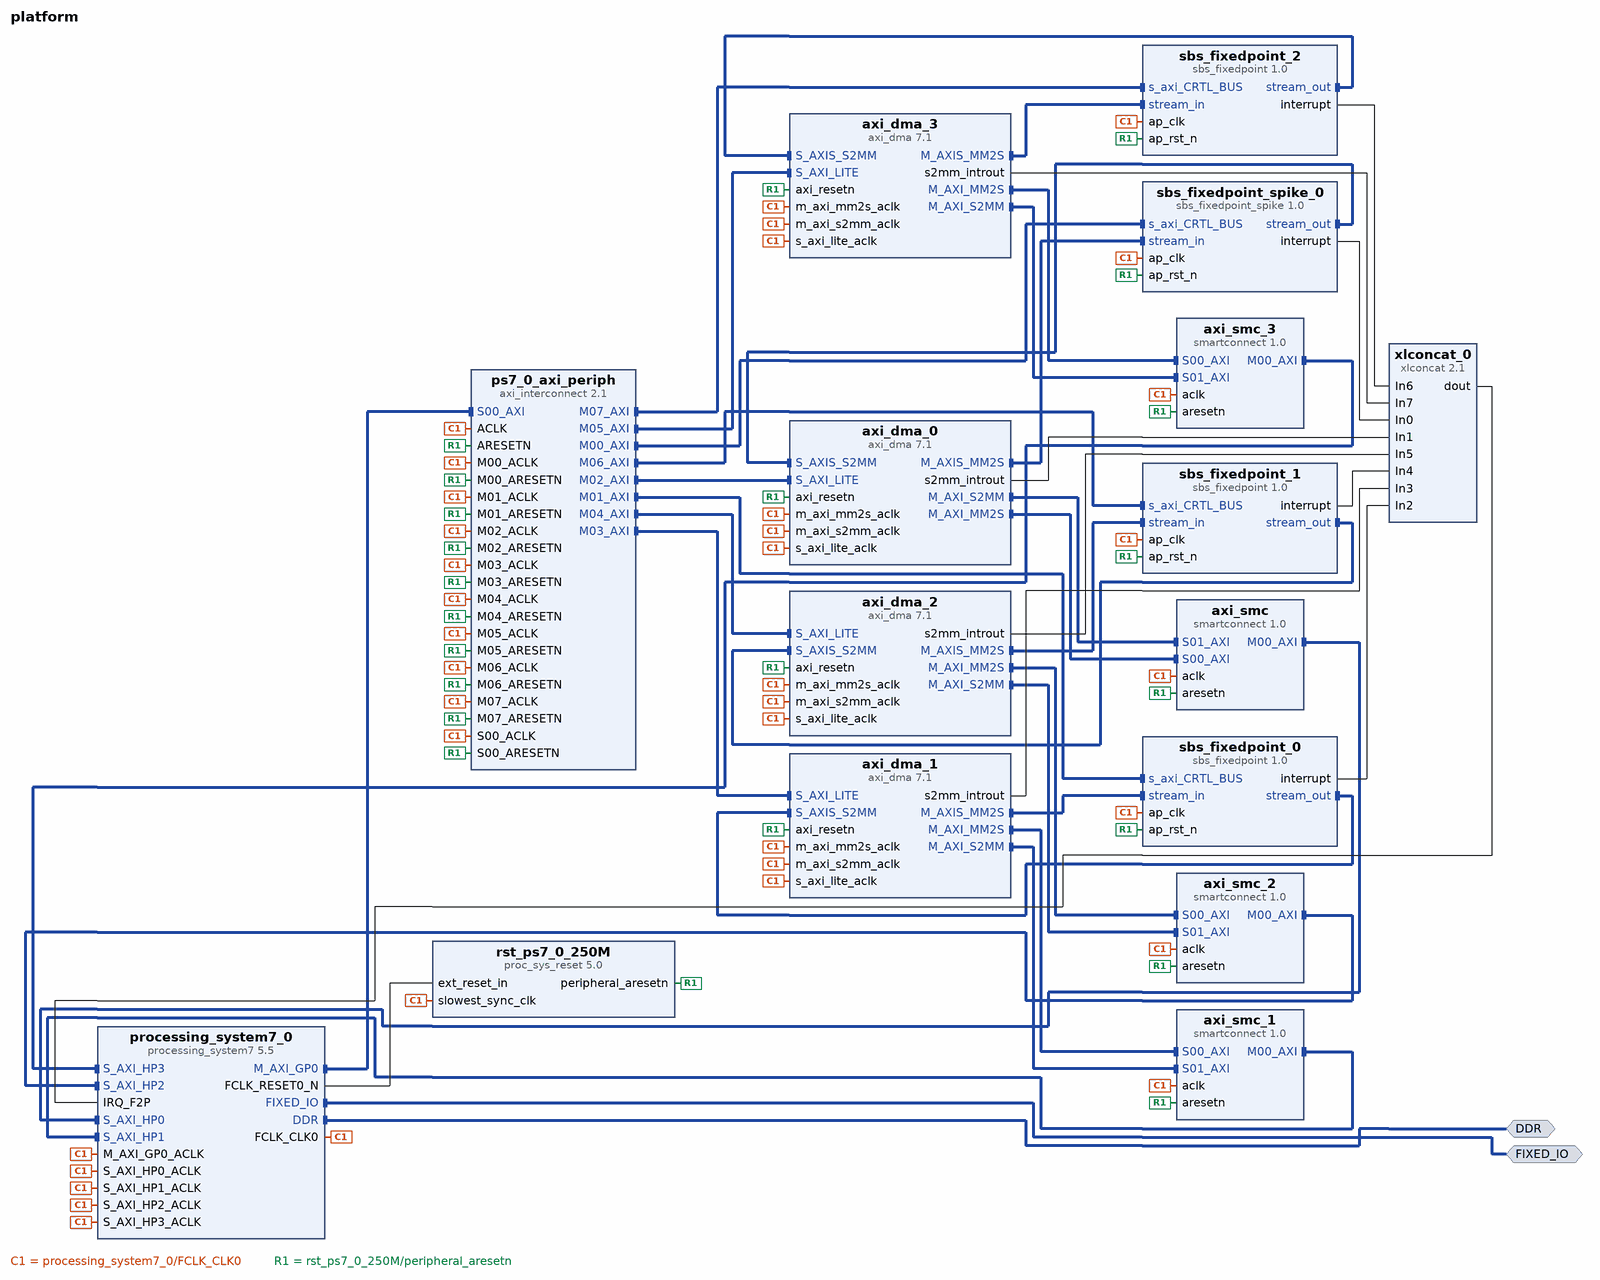
[diagram p0: block diagram of the top level]
# Vivado block design platform, xc7z020clg400-1, Vivado 2019.1.1
create_bd_design platform

create_bd_intf_port -mode Master -vlnv xilinx.com:interface:ddrx_rtl:1.0 DDR
create_bd_intf_port -mode Master -vlnv xilinx.com:display_processing_system7:fixedio_rtl:1.0 FIXED_IO

create_bd_cell -type ip -vlnv xilinx.com:ip:processing_system7:5.5 processing_system7_0
set_property -dict [list \
  CONFIG.PCW_APU_PERIPHERAL_FREQMHZ 667 \
  CONFIG.PCW_ENET0_ENET0_IO {MIO 16 .. 27} \
  CONFIG.PCW_ENET0_GRP_MDIO_ENABLE 1 \
  CONFIG.PCW_ENET0_GRP_MDIO_IO {MIO 52 .. 53} \
  CONFIG.PCW_ENET0_PERIPHERAL_ENABLE 1 \
  CONFIG.PCW_ENET0_RESET_ENABLE 0 \
  CONFIG.PCW_ENET_RESET_ENABLE 1 \
  CONFIG.PCW_ENET_RESET_SELECT {Share reset pin} \
  CONFIG.PCW_FPGA0_PERIPHERAL_FREQMHZ 250 \
  CONFIG.PCW_GPIO_MIO_GPIO_ENABLE 1 \
  CONFIG.PCW_GPIO_MIO_GPIO_IO MIO \
  CONFIG.PCW_I2C_RESET_ENABLE 1 \
  CONFIG.PCW_IRQ_F2P_INTR 1 \
  CONFIG.PCW_PRESET_BANK1_VOLTAGE {LVCMOS 1.8V} \
  CONFIG.PCW_QSPI_GRP_FBCLK_ENABLE 1 \
  CONFIG.PCW_QSPI_GRP_FBCLK_IO {MIO 8} \
  CONFIG.PCW_QSPI_GRP_SINGLE_SS_ENABLE 1 \
  CONFIG.PCW_QSPI_GRP_SINGLE_SS_IO {MIO 1 .. 6} \
  CONFIG.PCW_QSPI_PERIPHERAL_ENABLE 1 \
  CONFIG.PCW_QSPI_QSPI_IO {MIO 1 .. 6} \
  CONFIG.PCW_SD0_GRP_CD_ENABLE 1 \
  CONFIG.PCW_SD0_GRP_CD_IO {MIO 47} \
  CONFIG.PCW_SD0_GRP_WP_ENABLE 0 \
  CONFIG.PCW_SD0_PERIPHERAL_ENABLE 1 \
  CONFIG.PCW_SD0_SD0_IO {MIO 40 .. 45} \
  CONFIG.PCW_SDIO_PERIPHERAL_FREQMHZ 50 \
  CONFIG.PCW_SINGLE_QSPI_DATA_MODE x4 \
  CONFIG.PCW_UART1_PERIPHERAL_ENABLE 1 \
  CONFIG.PCW_UART1_UART1_IO {MIO 48 .. 49} \
  CONFIG.PCW_UART_PERIPHERAL_FREQMHZ 100 \
  CONFIG.PCW_UIPARAM_DDR_FREQ_MHZ 533.333333 \
  CONFIG.PCW_UIPARAM_DDR_MEMORY_TYPE {DDR 3 (Low Voltage)} \
  CONFIG.PCW_UIPARAM_DDR_PARTNO {MT41K256M16 RE-125} \
  CONFIG.PCW_USB0_PERIPHERAL_ENABLE 1 \
  CONFIG.PCW_USB0_RESET_ENABLE 1 \
  CONFIG.PCW_USB0_RESET_IO {MIO 46} \
  CONFIG.PCW_USB0_USB0_IO {MIO 28 .. 39} \
  CONFIG.PCW_USB_RESET_ENABLE 1 \
  CONFIG.PCW_USB_RESET_SELECT {Share reset pin} \
  CONFIG.PCW_USE_FABRIC_INTERRUPT 1 \
  CONFIG.PCW_USE_S_AXI_HP0 1 \
  CONFIG.PCW_USE_S_AXI_HP1 1 \
  CONFIG.PCW_USE_S_AXI_HP2 1 \
  CONFIG.PCW_USE_S_AXI_HP3 1 \
] [get_bd_cells processing_system7_0]
# 295 more settings of processing_system7_0 are not shown: defaults, MIO pin electricals, DDR timing, and values the tool derives
create_bd_cell -type ip -vlnv xilinx.com:hls:sbs_fixedpoint_spike:1.0 sbs_fixedpoint_spike_0
create_bd_cell -type ip -vlnv xilinx.com:hls:sbs_fixedpoint:1.0 sbs_fixedpoint_0
create_bd_cell -type ip -vlnv xilinx.com:ip:axi_dma:7.1 axi_dma_0
set_property -dict [list \
  CONFIG.c_include_mm2s_dre 1 \
  CONFIG.c_include_s2mm_dre 1 \
  CONFIG.c_include_sg 0 \
  CONFIG.c_mm2s_burst_size 256 \
  CONFIG.c_s2mm_burst_size 256 \
  CONFIG.c_sg_length_width 26 \
] [get_bd_cells axi_dma_0]
create_bd_cell -type ip -vlnv xilinx.com:ip:axi_dma:7.1 axi_dma_1
set_property -dict [list \
  CONFIG.c_include_mm2s_dre 1 \
  CONFIG.c_include_s2mm_dre 1 \
  CONFIG.c_include_sg 0 \
  CONFIG.c_mm2s_burst_size 256 \
  CONFIG.c_s2mm_burst_size 256 \
  CONFIG.c_sg_length_width 26 \
] [get_bd_cells axi_dma_1]
create_bd_cell -type ip -vlnv xilinx.com:ip:axi_dma:7.1 axi_dma_2
set_property -dict [list \
  CONFIG.c_include_mm2s_dre 1 \
  CONFIG.c_include_s2mm_dre 1 \
  CONFIG.c_include_sg 0 \
  CONFIG.c_mm2s_burst_size 256 \
  CONFIG.c_s2mm_burst_size 256 \
  CONFIG.c_sg_length_width 26 \
] [get_bd_cells axi_dma_2]
create_bd_cell -type ip -vlnv xilinx.com:ip:axi_dma:7.1 axi_dma_3
set_property -dict [list \
  CONFIG.c_include_mm2s_dre 1 \
  CONFIG.c_include_s2mm_dre 1 \
  CONFIG.c_include_sg 0 \
  CONFIG.c_mm2s_burst_size 256 \
  CONFIG.c_s2mm_burst_size 256 \
  CONFIG.c_sg_length_width 26 \
] [get_bd_cells axi_dma_3]
create_bd_cell -type ip -vlnv xilinx.com:hls:sbs_fixedpoint:1.0 sbs_fixedpoint_1
create_bd_cell -type ip -vlnv xilinx.com:hls:sbs_fixedpoint:1.0 sbs_fixedpoint_2
create_bd_cell -type ip -vlnv xilinx.com:ip:xlconcat:2.1 xlconcat_0
set_property -dict {CONFIG.NUM_PORTS 8} [get_bd_cells xlconcat_0]
create_bd_cell -type ip -vlnv xilinx.com:ip:smartconnect:1.0 axi_smc
set_property -dict {CONFIG.NUM_SI 2} [get_bd_cells axi_smc]
create_bd_cell -type ip -vlnv xilinx.com:ip:proc_sys_reset:5.0 rst_ps7_0_250M
create_bd_cell -type ip -vlnv xilinx.com:ip:smartconnect:1.0 axi_smc_1
set_property -dict {CONFIG.NUM_SI 2} [get_bd_cells axi_smc_1]
create_bd_cell -type ip -vlnv xilinx.com:ip:smartconnect:1.0 axi_smc_2
set_property -dict {CONFIG.NUM_SI 2} [get_bd_cells axi_smc_2]
create_bd_cell -type ip -vlnv xilinx.com:ip:smartconnect:1.0 axi_smc_3
set_property -dict {CONFIG.NUM_SI 2} [get_bd_cells axi_smc_3]
create_bd_cell -type ip -vlnv xilinx.com:ip:axi_interconnect:2.1 ps7_0_axi_periph
set_property -dict {CONFIG.NUM_MI 8} [get_bd_cells ps7_0_axi_periph]

# ---- connections ----

connect_bd_intf_net [get_bd_intf_pins ps7_0_axi_periph/M00_AXI] [get_bd_intf_pins sbs_fixedpoint_spike_0/s_axi_CRTL_BUS]
connect_bd_intf_net [get_bd_intf_pins processing_system7_0/M_AXI_GP0] [get_bd_intf_pins ps7_0_axi_periph/S00_AXI]
connect_bd_intf_net [get_bd_intf_pins axi_dma_2/M_AXI_MM2S] [get_bd_intf_pins axi_smc_2/S00_AXI]
connect_bd_intf_net [get_bd_intf_pins axi_smc_2/M00_AXI] [get_bd_intf_pins processing_system7_0/S_AXI_HP2]
connect_bd_intf_net [get_bd_intf_pins ps7_0_axi_periph/M01_AXI] [get_bd_intf_pins sbs_fixedpoint_0/s_axi_CRTL_BUS]
connect_bd_intf_net [get_bd_intf_pins axi_dma_3/M_AXI_MM2S] [get_bd_intf_pins axi_smc_3/S00_AXI]
connect_bd_intf_net [get_bd_intf_pins ps7_0_axi_periph/M06_AXI] [get_bd_intf_pins sbs_fixedpoint_1/s_axi_CRTL_BUS]
connect_bd_intf_net [get_bd_intf_pins ps7_0_axi_periph/M05_AXI] [get_bd_intf_pins axi_dma_3/S_AXI_LITE]
connect_bd_intf_net [get_bd_intf_pins axi_dma_3/M_AXI_S2MM] [get_bd_intf_pins axi_smc_3/S01_AXI]
connect_bd_intf_net [get_bd_intf_pins axi_dma_2/M_AXI_S2MM] [get_bd_intf_pins axi_smc_2/S01_AXI]
connect_bd_intf_net [get_bd_intf_pins sbs_fixedpoint_1/stream_out] [get_bd_intf_pins axi_dma_2/S_AXIS_S2MM]
connect_bd_intf_net [get_bd_intf_pins axi_dma_2/M_AXIS_MM2S] [get_bd_intf_pins sbs_fixedpoint_1/stream_in]
connect_bd_intf_net [get_bd_intf_pins sbs_fixedpoint_0/stream_out] [get_bd_intf_pins axi_dma_1/S_AXIS_S2MM]
connect_bd_intf_net [get_bd_intf_pins axi_dma_3/M_AXIS_MM2S] [get_bd_intf_pins sbs_fixedpoint_2/stream_in]
connect_bd_intf_net [get_bd_intf_pins axi_dma_1/M_AXIS_MM2S] [get_bd_intf_pins sbs_fixedpoint_0/stream_in]
connect_bd_intf_net [get_bd_intf_pins sbs_fixedpoint_2/stream_out] [get_bd_intf_pins axi_dma_3/S_AXIS_S2MM]
connect_bd_intf_net [get_bd_intf_pins ps7_0_axi_periph/M07_AXI] [get_bd_intf_pins sbs_fixedpoint_2/s_axi_CRTL_BUS]
connect_bd_intf_net [get_bd_intf_pins axi_dma_0/M_AXIS_MM2S] [get_bd_intf_pins sbs_fixedpoint_spike_0/stream_in]
connect_bd_intf_net [get_bd_intf_pins sbs_fixedpoint_spike_0/stream_out] [get_bd_intf_pins axi_dma_0/S_AXIS_S2MM]
connect_bd_intf_net [get_bd_intf_pins axi_smc_3/M00_AXI] [get_bd_intf_pins processing_system7_0/S_AXI_HP3]
connect_bd_intf_net [get_bd_intf_pins axi_dma_0/M_AXI_S2MM] [get_bd_intf_pins axi_smc/S01_AXI]
connect_bd_intf_net [get_bd_intf_ports FIXED_IO] [get_bd_intf_pins processing_system7_0/FIXED_IO]
connect_bd_intf_net [get_bd_intf_ports DDR] [get_bd_intf_pins processing_system7_0/DDR]
connect_bd_intf_net [get_bd_intf_pins ps7_0_axi_periph/M02_AXI] [get_bd_intf_pins axi_dma_0/S_AXI_LITE]
connect_bd_intf_net [get_bd_intf_pins ps7_0_axi_periph/M03_AXI] [get_bd_intf_pins axi_dma_1/S_AXI_LITE]
connect_bd_intf_net [get_bd_intf_pins ps7_0_axi_periph/M04_AXI] [get_bd_intf_pins axi_dma_2/S_AXI_LITE]
connect_bd_intf_net [get_bd_intf_pins axi_dma_0/M_AXI_MM2S] [get_bd_intf_pins axi_smc/S00_AXI]
connect_bd_intf_net [get_bd_intf_pins axi_smc/M00_AXI] [get_bd_intf_pins processing_system7_0/S_AXI_HP0]
connect_bd_intf_net [get_bd_intf_pins axi_smc_1/M00_AXI] [get_bd_intf_pins processing_system7_0/S_AXI_HP1]
connect_bd_intf_net [get_bd_intf_pins axi_dma_1/M_AXI_MM2S] [get_bd_intf_pins axi_smc_1/S00_AXI]
connect_bd_intf_net [get_bd_intf_pins axi_dma_1/M_AXI_S2MM] [get_bd_intf_pins axi_smc_1/S01_AXI]
connect_bd_net [get_bd_pins xlconcat_0/dout] [get_bd_pins processing_system7_0/IRQ_F2P]
connect_bd_net [get_bd_pins sbs_fixedpoint_spike_0/interrupt] [get_bd_pins xlconcat_0/In0]
connect_bd_net [get_bd_pins axi_dma_0/s2mm_introut] [get_bd_pins xlconcat_0/In1]
connect_bd_net [get_bd_pins sbs_fixedpoint_0/interrupt] [get_bd_pins xlconcat_0/In2]
connect_bd_net [get_bd_pins axi_dma_1/s2mm_introut] [get_bd_pins xlconcat_0/In3]
connect_bd_net [get_bd_pins sbs_fixedpoint_1/interrupt] [get_bd_pins xlconcat_0/In4]
connect_bd_net [get_bd_pins axi_dma_2/s2mm_introut] [get_bd_pins xlconcat_0/In5]
connect_bd_net [get_bd_pins sbs_fixedpoint_2/interrupt] [get_bd_pins xlconcat_0/In6]
connect_bd_net [get_bd_pins axi_dma_3/s2mm_introut] [get_bd_pins xlconcat_0/In7]
connect_bd_net [get_bd_pins processing_system7_0/FCLK_CLK0] \
  [get_bd_pins axi_dma_0/m_axi_mm2s_aclk] [get_bd_pins axi_smc/aclk] [get_bd_pins processing_system7_0/S_AXI_HP0_ACLK] \
  [get_bd_pins rst_ps7_0_250M/slowest_sync_clk] [get_bd_pins axi_dma_1/m_axi_mm2s_aclk] [get_bd_pins axi_smc_1/aclk] \
  [get_bd_pins processing_system7_0/S_AXI_HP1_ACLK] [get_bd_pins axi_dma_2/m_axi_mm2s_aclk] [get_bd_pins axi_smc_2/aclk] \
  [get_bd_pins processing_system7_0/S_AXI_HP2_ACLK] [get_bd_pins axi_dma_3/m_axi_mm2s_aclk] [get_bd_pins axi_smc_3/aclk] \
  [get_bd_pins processing_system7_0/S_AXI_HP3_ACLK] [get_bd_pins processing_system7_0/M_AXI_GP0_ACLK] \
  [get_bd_pins ps7_0_axi_periph/S00_ACLK] [get_bd_pins sbs_fixedpoint_spike_0/ap_clk] [get_bd_pins ps7_0_axi_periph/M00_ACLK] \
  [get_bd_pins ps7_0_axi_periph/ACLK] [get_bd_pins sbs_fixedpoint_0/ap_clk] [get_bd_pins ps7_0_axi_periph/M01_ACLK] \
  [get_bd_pins axi_dma_0/s_axi_lite_aclk] [get_bd_pins ps7_0_axi_periph/M02_ACLK] [get_bd_pins axi_dma_1/s_axi_lite_aclk] \
  [get_bd_pins ps7_0_axi_periph/M03_ACLK] [get_bd_pins axi_dma_2/s_axi_lite_aclk] [get_bd_pins ps7_0_axi_periph/M04_ACLK] \
  [get_bd_pins axi_dma_3/s_axi_lite_aclk] [get_bd_pins ps7_0_axi_periph/M05_ACLK] [get_bd_pins sbs_fixedpoint_1/ap_clk] \
  [get_bd_pins ps7_0_axi_periph/M06_ACLK] [get_bd_pins sbs_fixedpoint_2/ap_clk] [get_bd_pins ps7_0_axi_periph/M07_ACLK] \
  [get_bd_pins axi_dma_0/m_axi_s2mm_aclk] [get_bd_pins axi_dma_1/m_axi_s2mm_aclk] [get_bd_pins axi_dma_2/m_axi_s2mm_aclk] \
  [get_bd_pins axi_dma_3/m_axi_s2mm_aclk]
connect_bd_net [get_bd_pins processing_system7_0/FCLK_RESET0_N] [get_bd_pins rst_ps7_0_250M/ext_reset_in]
connect_bd_net [get_bd_pins rst_ps7_0_250M/peripheral_aresetn] \
  [get_bd_pins axi_smc/aresetn] [get_bd_pins axi_smc_1/aresetn] [get_bd_pins axi_smc_2/aresetn] \
  [get_bd_pins axi_smc_3/aresetn] [get_bd_pins ps7_0_axi_periph/S00_ARESETN] [get_bd_pins sbs_fixedpoint_spike_0/ap_rst_n] \
  [get_bd_pins ps7_0_axi_periph/M00_ARESETN] [get_bd_pins ps7_0_axi_periph/ARESETN] [get_bd_pins sbs_fixedpoint_0/ap_rst_n] \
  [get_bd_pins ps7_0_axi_periph/M01_ARESETN] [get_bd_pins axi_dma_0/axi_resetn] [get_bd_pins ps7_0_axi_periph/M02_ARESETN] \
  [get_bd_pins axi_dma_1/axi_resetn] [get_bd_pins ps7_0_axi_periph/M03_ARESETN] [get_bd_pins axi_dma_2/axi_resetn] \
  [get_bd_pins ps7_0_axi_periph/M04_ARESETN] [get_bd_pins axi_dma_3/axi_resetn] [get_bd_pins ps7_0_axi_periph/M05_ARESETN] \
  [get_bd_pins sbs_fixedpoint_1/ap_rst_n] [get_bd_pins ps7_0_axi_periph/M06_ARESETN] [get_bd_pins sbs_fixedpoint_2/ap_rst_n] \
  [get_bd_pins ps7_0_axi_periph/M07_ARESETN]

# ---- address map ----
assign_bd_address -offset 0x00000000 -range 1G -target_address_space [get_bd_addr_spaces axi_dma_0/Data_MM2S] [get_bd_addr_segs processing_system7_0/S_AXI_HP0/HP0_DDR_LOWOCM]
assign_bd_address -offset 0x00000000 -range 1G -target_address_space [get_bd_addr_spaces axi_dma_0/Data_S2MM] [get_bd_addr_segs processing_system7_0/S_AXI_HP0/HP0_DDR_LOWOCM]
assign_bd_address -offset 0x00000000 -range 1G -target_address_space [get_bd_addr_spaces axi_dma_1/Data_MM2S] [get_bd_addr_segs processing_system7_0/S_AXI_HP1/HP1_DDR_LOWOCM]
assign_bd_address -offset 0x00000000 -range 1G -target_address_space [get_bd_addr_spaces axi_dma_1/Data_S2MM] [get_bd_addr_segs processing_system7_0/S_AXI_HP1/HP1_DDR_LOWOCM]
assign_bd_address -offset 0x00000000 -range 1G -target_address_space [get_bd_addr_spaces axi_dma_2/Data_MM2S] [get_bd_addr_segs processing_system7_0/S_AXI_HP2/HP2_DDR_LOWOCM]
assign_bd_address -offset 0x00000000 -range 1G -target_address_space [get_bd_addr_spaces axi_dma_2/Data_S2MM] [get_bd_addr_segs processing_system7_0/S_AXI_HP2/HP2_DDR_LOWOCM]
assign_bd_address -offset 0x00000000 -range 1G -target_address_space [get_bd_addr_spaces axi_dma_3/Data_MM2S] [get_bd_addr_segs processing_system7_0/S_AXI_HP3/HP3_DDR_LOWOCM]
assign_bd_address -offset 0x00000000 -range 1G -target_address_space [get_bd_addr_spaces axi_dma_3/Data_S2MM] [get_bd_addr_segs processing_system7_0/S_AXI_HP3/HP3_DDR_LOWOCM]
assign_bd_address -offset 0x40400000 -range 64K -target_address_space [get_bd_addr_spaces processing_system7_0/Data] [get_bd_addr_segs axi_dma_0/S_AXI_LITE/Reg]
assign_bd_address -offset 0x40410000 -range 64K -target_address_space [get_bd_addr_spaces processing_system7_0/Data] [get_bd_addr_segs axi_dma_1/S_AXI_LITE/Reg]
assign_bd_address -offset 0x40420000 -range 64K -target_address_space [get_bd_addr_spaces processing_system7_0/Data] [get_bd_addr_segs axi_dma_2/S_AXI_LITE/Reg]
assign_bd_address -offset 0x40430000 -range 64K -target_address_space [get_bd_addr_spaces processing_system7_0/Data] [get_bd_addr_segs axi_dma_3/S_AXI_LITE/Reg]
assign_bd_address -offset 0x43C00000 -range 64K -target_address_space [get_bd_addr_spaces processing_system7_0/Data] [get_bd_addr_segs sbs_fixedpoint_spike_0/s_axi_CRTL_BUS/Reg]
assign_bd_address -offset 0x43C10000 -range 64K -target_address_space [get_bd_addr_spaces processing_system7_0/Data] [get_bd_addr_segs sbs_fixedpoint_0/s_axi_CRTL_BUS/Reg]
assign_bd_address -offset 0x43C20000 -range 64K -target_address_space [get_bd_addr_spaces processing_system7_0/Data] [get_bd_addr_segs sbs_fixedpoint_1/s_axi_CRTL_BUS/Reg]
assign_bd_address -offset 0x43C30000 -range 64K -target_address_space [get_bd_addr_spaces processing_system7_0/Data] [get_bd_addr_segs sbs_fixedpoint_2/s_axi_CRTL_BUS/Reg]

validate_bd_design
save_bd_design
